# EasyEDA Pro project HNDX.eprj, schematic Schematic6
Board Name: ttl-232; Create Date: 2025-07-08; Page Name: P1; Project Name: GP; Schematic Name: Schematic6; Update Date: 2025-07-08; Company: 嘉立创EDA; Page Size: A4; Version: V1.0
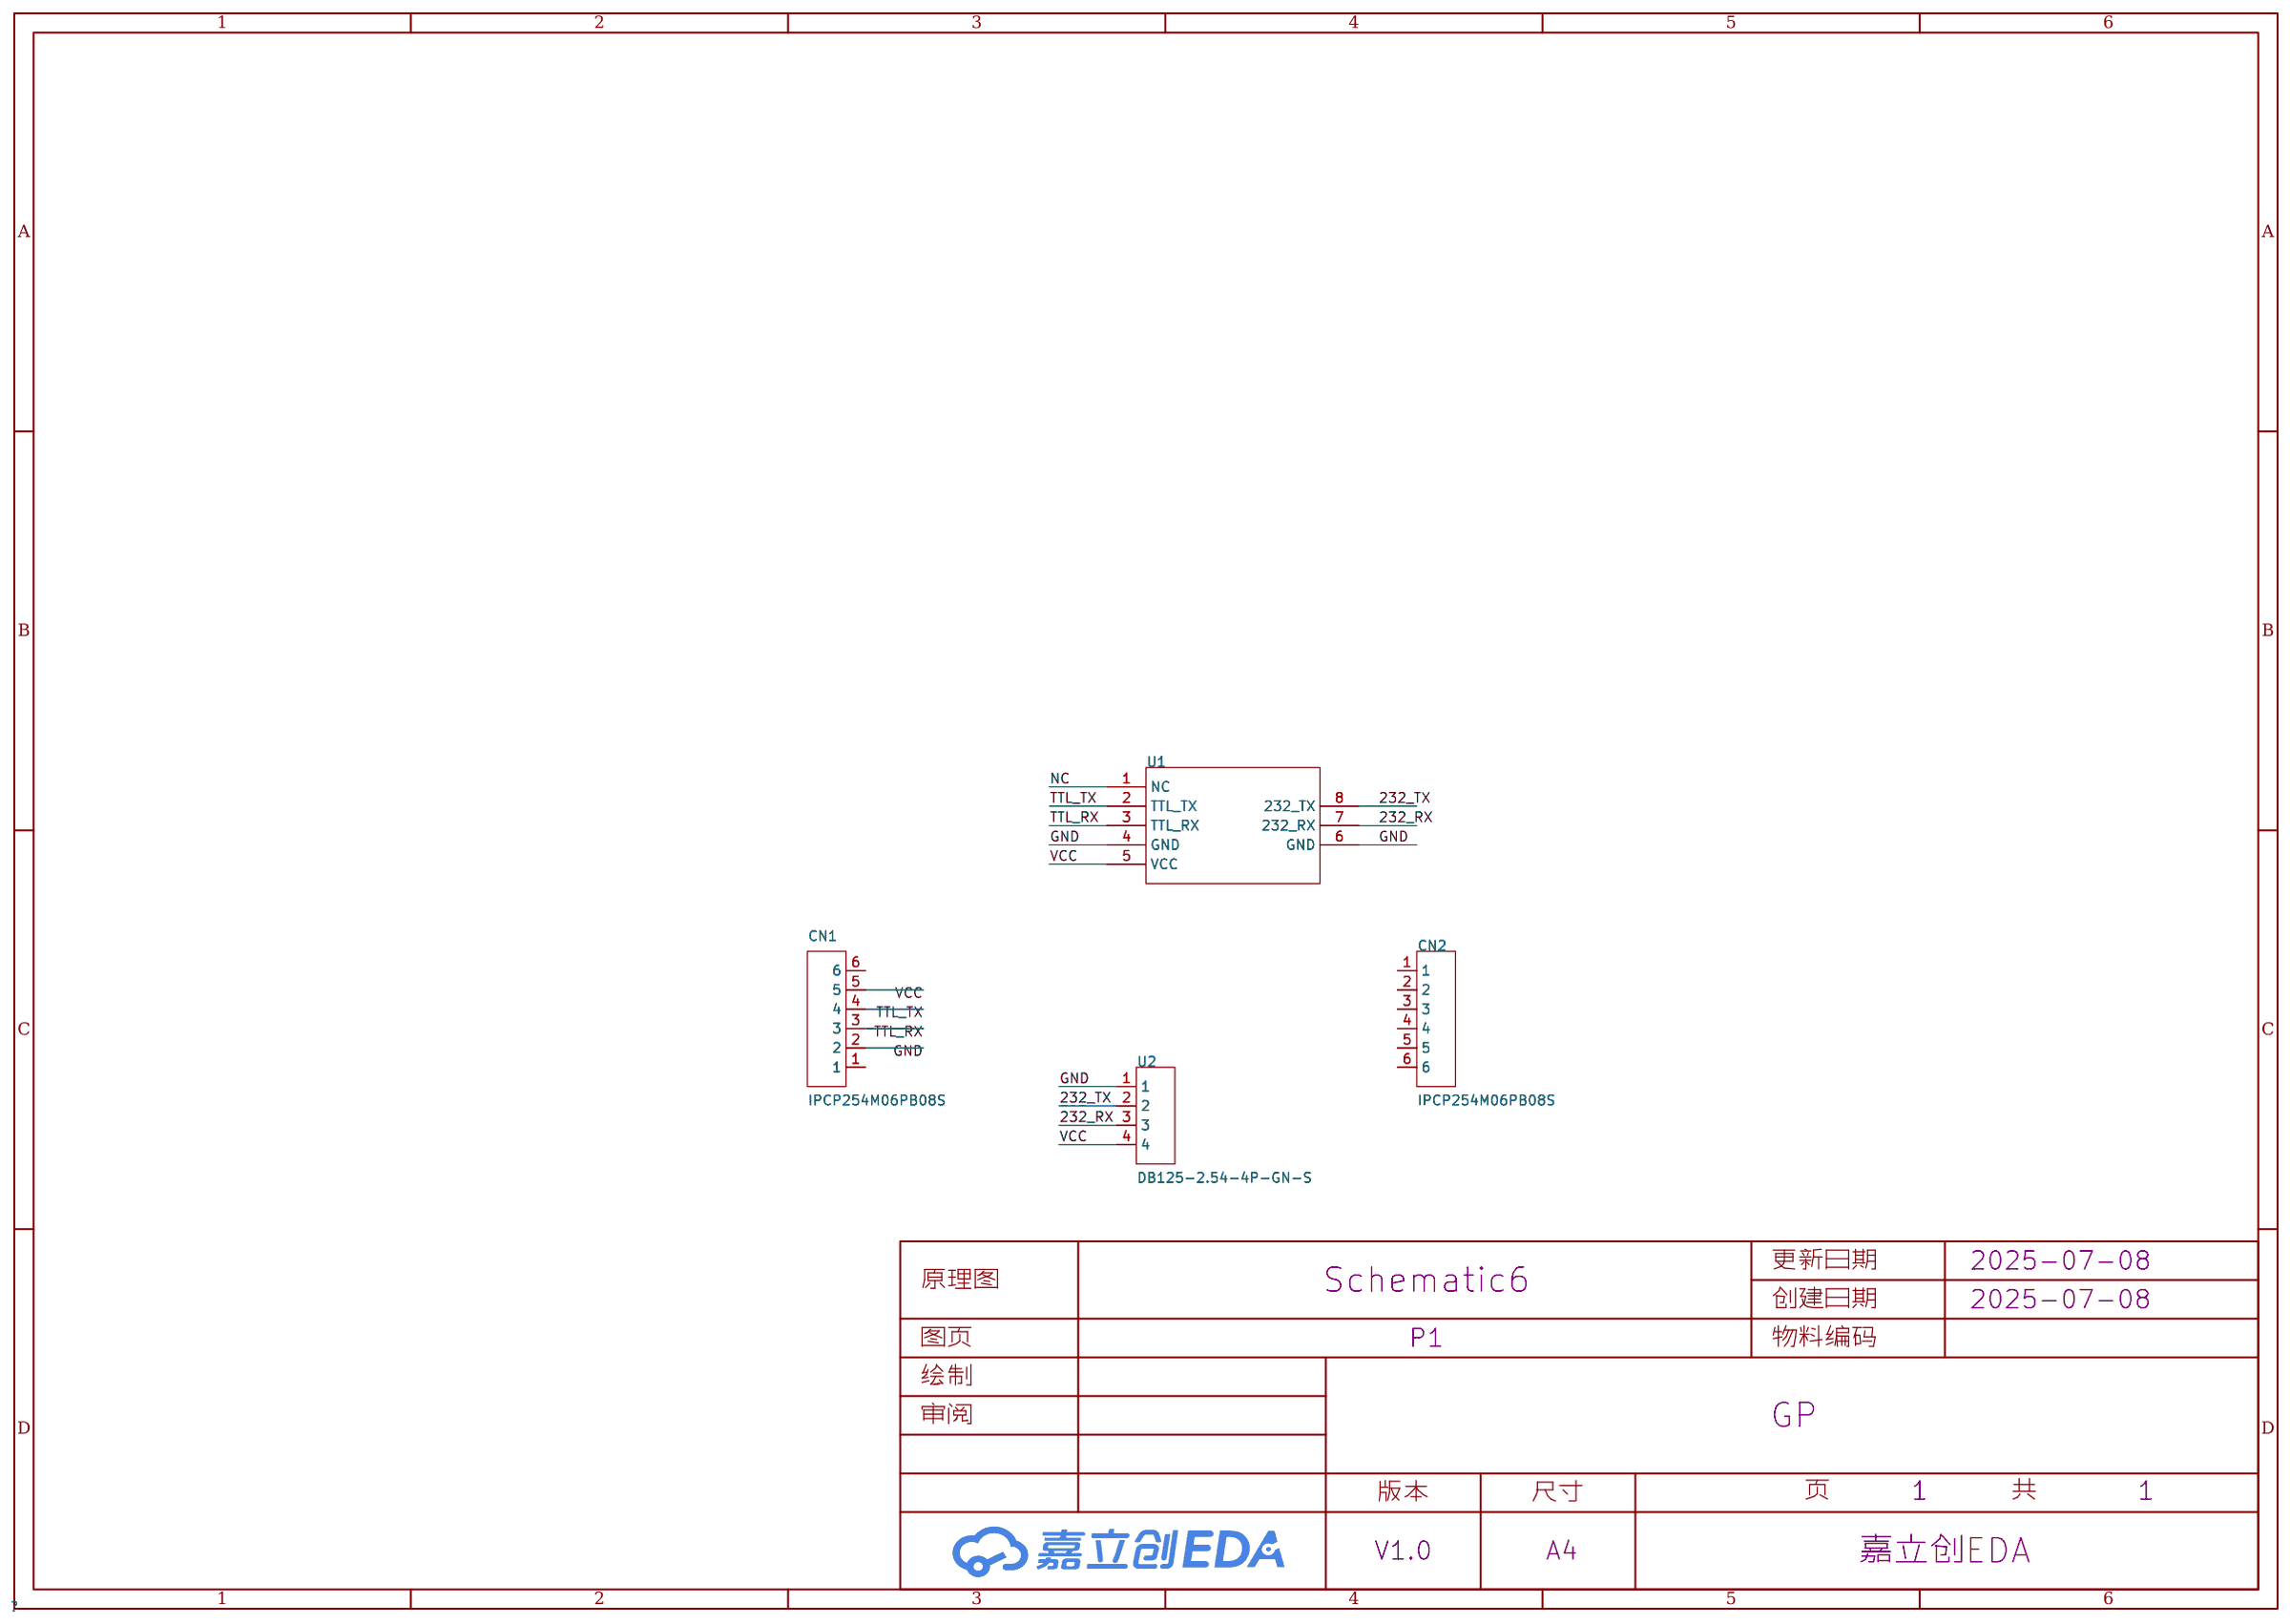
[diagram p7: schematic sheet]

## Parts
CN1  IPCP254M06PB08S  [HDR-SMD_6P-P2.54-V-M-S4.8]
CN2  IPCP254M06PB08S  [HDR-SMD_6P-P2.54-V-M-S4.8]
U1  -  [ttl-232]
U2  DB125-2.54-4P-GN-S  [CONN-TH_DB125-2.54-4P-GN]

## Library data of the parts
CN1 CN2 = IPCP254M06PB08S: LCSC Part Name: 1x6P 间距:2.54mm 方针 立贴; Supplier Part: C22438430; Manufacturer: INCP; Supplier Footprint: SMD,P=2.54mm(交错脚); JLCPCB Part Class: 扩展库; Datasheet: https://atta.szlcsc.com/upload/public/pdf/source/20240523/B4FE6A2C412EE3021DC2B129EE5E4118.pdf; Supplier: LCSC; Pin Structure: 1x6P; Pitch: 2.54mm; Circluar Pins/Square Pins: 方针; Mounting Type: 立贴; Number of Rows: 单排; Number of Pins: 6P; Current Rating: 3A; Insulation Height: 2.5mm; Contact Material: 黄铜; Contact Plating: 金; Operating Temperature: -40℃~+105℃; Color: 黑色
U1 = ttl-232
U2 = DB125-2.54-4P-GN-S: LCSC Part Name: 1x4P 2.54mm 直插 排数:1 每排P数:4; Supplier Part: C918122; Manufacturer: DORABO(地博电气); Supplier Footprint: 插件,P=2.54mm; JLCPCB Part Class: 扩展库; Datasheet: https://atta.szlcsc.com/upload/public/pdf/source/20230106/BCD3A0BE1EB95DC3E813F1745F022035.pdf; Supplier: LCSC; Number of Positions or Pins: 1x4P; Pitch: 2.54mm; Color: 绿色; Mounting Type: 直插; Number of Pins: 4P; Number of Rows: 1; Number of PINs Per Row: 4; Current Rating: 7A; Voltage Rating (Max): 150V; Wire Gauge - AWG: 18~26; Wire Gauge - mm2: 1; Operating Temperature: -40℃~+105℃

## Nets
GND: CN1.2 U1.4(GND) U1.6(GND) U2.1
VCC: CN1.5 U1.5(VCC) U2.4
232_RX: U1.7(232_RX) U2.3
232_TX: U1.8(232_TX) U2.2
NC: U1.1(NC)
TTL_RX: CN1.3 U1.3(TTL_RX)
TTL_TX: CN1.4 U1.2(TTL_TX)

Not connected (* = marked no-connect by the designer): CN1 1 6; CN2 1 2 3 4 5 6
